# EAGLE design SimpleTimerPCB (EAGLE 6.5.0)
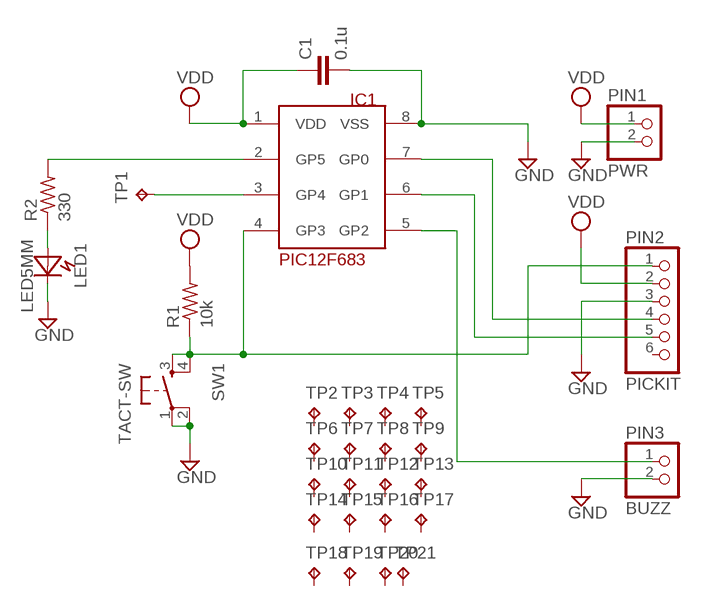
[diagram p0: schematic, sheet 1]

## Parts
C1  0.1u  C-EU025-024X044  [C025-024X044]
LED1  LED5MM  [LED_5MM]
PIC12F683  IC1  PIC12F683DIP  [DIL08]
PIN1  PWR  PINHD-1X2  [1X02]
PIN2  PICKIT  PINHD-1X6  [1X06]
PIN3  BUZZ  PINHD-1X2  [1X02]
R1  10k  R-US_0207/10  [0207/10]
R2  330  R-US_0207/10  [0207/10]
SW1  TACT-SW  [B3F-10X]
TP1  TPPAD1-17  [P1-17]
TP2  TPNORMAL  [TPAD-NORM]
TP3  TPNORMAL  [TPAD-NORM]
TP4  TPNORMAL  [TPAD-NORM]
TP5  TPNORMAL  [TPAD-NORM]
TP6  TPNORMAL  [TPAD-NORM]
TP7  TPNORMAL  [TPAD-NORM]
TP8  TPNORMAL  [TPAD-NORM]
TP9  TPNORMAL  [TPAD-NORM]
TP10  TPNORMAL  [TPAD-NORM]
TP11  TPNORMAL  [TPAD-NORM]
TP12  TPNORMAL  [TPAD-NORM]
TP13  TPNORMAL  [TPAD-NORM]
TP14  TPNORMAL  [TPAD-NORM]
TP15  TPNORMAL  [TPAD-NORM]
TP16  TPNORMAL  [TPAD-NORM]
TP17  TPNORMAL  [TPAD-NORM]
TP18  TPNORMAL  [TPAD-NORM]
TP19  TPNORMAL  [TPAD-NORM]
TP20  TPNORMAL  [TPAD-NORM]
TP21  TPNORMAL  [TPAD-NORM]

## Nets
GND [Power]: C1.2 LED1.K PIC12F683.8(VSS) PIN1.2 PIN2.3 PIN3.2 SW1.1(P) SW1.2(P1)
N$1: PIC12F683.4(GP3) PIN2.1 R1.1 SW1.3(S) SW1.4(S1)
N$3: PIC12F683.3(GP4) TP1.TP
N$4: PIC12F683.7(GP0) PIN2.4
N$5: PIC12F683.6(GP1) PIN2.5
N$6: PIC12F683.5(GP2) PIN3.1
N$7 [Power]: LED1.A R2.1
N$8 [Power]: PIC12F683.2(GP5) R2.2
VDD [Power]: C1.1 PIC12F683.1(VDD) PIN1.1 PIN2.2 R1.2
Unconnected: PIN2.6 TP2.P$1(TP) TP3.P$1(TP) TP4.P$1(TP) TP5.P$1(TP) TP6.P$1(TP) TP7.P$1(TP) TP8.P$1(TP) TP9.P$1(TP) TP10.P$1(TP) TP11.P$1(TP) TP12.P$1(TP) TP13.P$1(TP) TP14.P$1(TP) TP15.P$1(TP) TP16.P$1(TP) TP17.P$1(TP) TP18.P$1(TP) TP19.P$1(TP) TP20.P$1(TP) TP21.P$1(TP)

## Library data of the parts
C1 = MyOriginal:C-EU: CAPACITOR, European symbol
LED1 = MyOriginal:LED: 3mm LED
PIC12F683 = MyOriginal:PIC12F683: PIC12F683 Microchip PIC12F683
PIN1 PIN3 = MyOriginal:PINHD-1X2: PIN HEADER
PIN2 = MyOriginal:PINHD-1X6: PIN HEADER
R1 R2 = rcl:R-US_: RESISTOR, American symbol
SW1 = MyOriginal:TACT-SW: Tacticle Push Switch
TP1-TP21 = MyOriginal:TP: Test pad

## Net classes
0 default: width 0.61 mm, clearance 0.508 mm
1 Power: width 0.914 mm, clearance 0.508 mm
2 GND: width 0.914 mm, clearance 0.508 mm

## Board
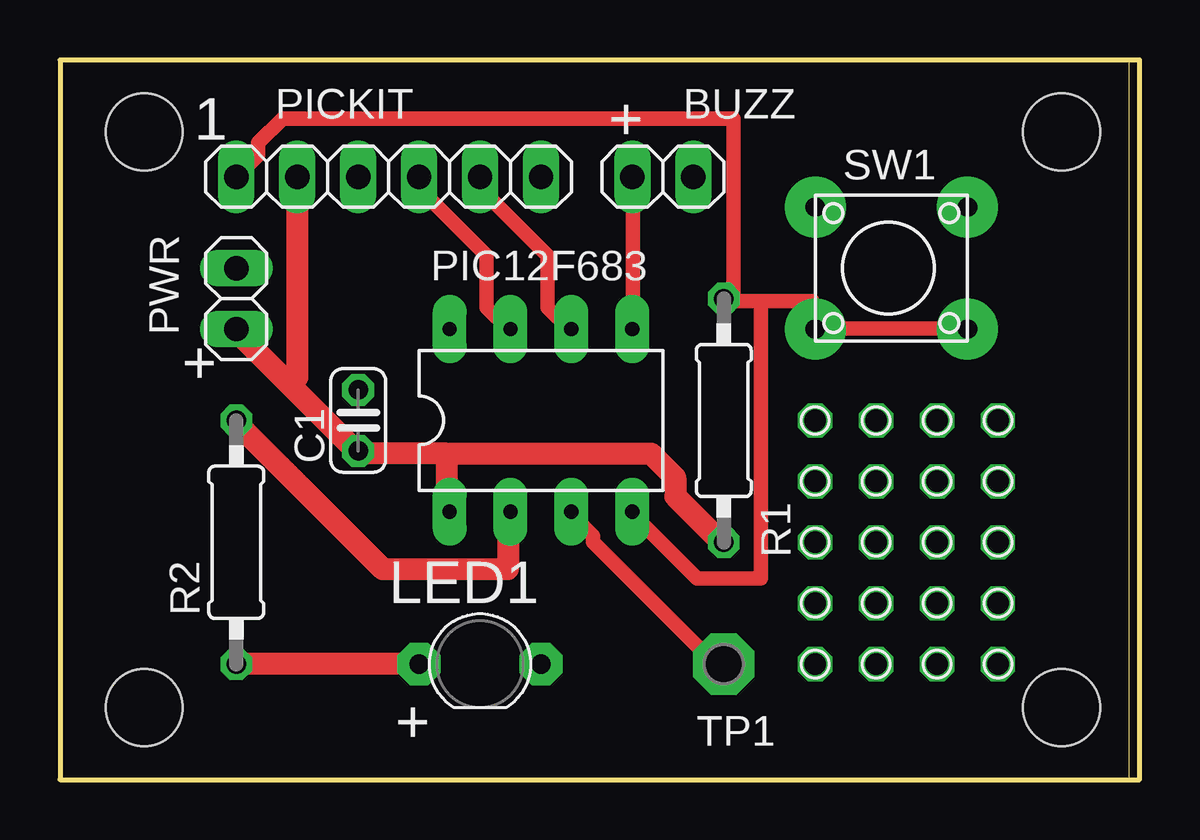
[diagram p1: board, top side]
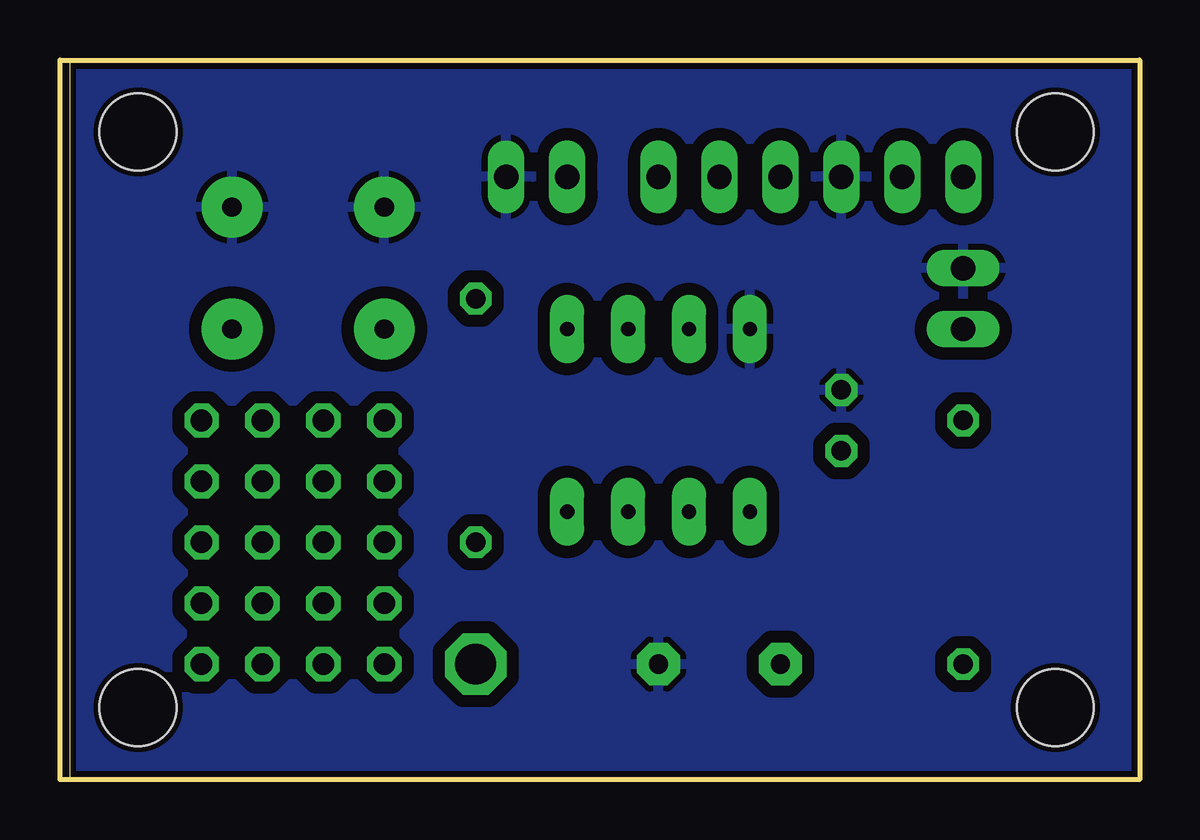
[diagram p2: board, bottom side, seen from below]

Size 45 x 30 mm. Coordinates in mm from the lower left corner, seen from the top.
Outline: 0,0 44.58,0 44.58,29.93 0,29.93 0,0
Outline: 0,0 45,0 45,30 0,30 0,0
Copper layers (1*16): Top 0.035mm / dielectric 1.5mm / Bottom 0.035mm
Design rules "Elecrow_2-layer_eagle_rule": minimum track width 6mil, minimum drill 12mil, track to track 6mil, track to pad 6mil, pad to pad 6mil, via to via 6mil, smd to smd 0mil, copper to edge 10mil, drill to drill 10mil, minimum pad ring 10mil, minimum via ring 6mil, stop-mask expansion 2mil, vias tented up to drill 100mil, thermal gap 10mil
Holes 3.2 mm at 3.51,27 3.51,3 41.75,3 41.75,27

### Footprints (pad centres in the part's own frame; a part is rotated, then mirrored left to right if it is on the bottom)
C025-024X044 = drill 0.813 octagon: 1 -1.27,0; 2 1.27,0
LED_5MM = drill 0.8 pad 1.778 octagon: A -2.54,0; K 2.54,0
DIL08 = drill 0.6 pad 1.422 long: 1 -3.81,-3.81; 2 -1.27,-3.81; 3 1.27,-3.81; 4 3.81,-3.81; 5 3.81,3.81; 6 1.27,3.81; 7 -1.27,3.81; 8 -3.81,3.81
1X02 = drill 1.016 long: 1 -1.27,0; 2 1.27,0
1X06 = drill 1.016 long: 1 -6.35,0; 2 -3.81,0; 3 -1.27,0; 4 1.27,0; 5 3.81,0; 6 6.35,0
0207/10 = drill 0.813 octagon: 1 -5.08,0; 2 5.08,0
B3F-10X = drill 0.8 pad 2.54: 1 -1.27,2.54; 2 5.08,2.54; 3 -1.27,-2.54; 4 5.08,-2.54
P1-17 = drill 1.702 pad 2.54 octagon: TP 0,0
TPAD-NORM = drill 0.9 pad 1.422 octagon: P$1 0,0

### Placement (x,y rotation side)
C1  12.43,14.97 90 top
LED1  17.51,4.81 0 top
PIC12F683  20.05,14.97 0 top
PIN1  7.35,20.05 90 top
PIN2  13.7,25.13 0 top
PIN3  25.13,25.13 0 top
R1  27.67,14.97 270 top
R2  7.35,9.89 90 top
SW1  32.75,21.32 0 top
TP1  27.67,4.81 0 top
TP2  31.48,14.97 0 top
TP3  34.02,14.97 0 top
TP4  36.56,14.97 0 top
TP5  39.1,14.97 0 top
TP6  31.48,12.43 0 top
TP7  34.02,12.43 0 top
TP8  36.56,12.43 0 top
TP9  39.1,12.43 0 top
TP10  31.48,9.89 0 top
TP11  34.02,9.89 0 top
TP12  36.56,9.89 0 top
TP13  39.1,9.89 0 top
TP14  31.48,7.35 0 top
TP15  34.02,7.35 0 top
TP16  36.56,7.35 0 top
TP17  39.1,7.35 0 top
TP18  31.48,4.81 0 top
TP19  34.02,4.81 0 top
TP20  36.56,4.81 0 top
TP21  39.1,4.81 0 top

### Tracks (layer width: path | path; a pad name or v marks a point on that pad's centre or on a via)
GND
  pour Bottom: 0.25,29.46 0.25,0.25 43.94,0.25 43.94,0.51 44.2,0.51 44.2,29.72 0.25,29.72
N$1
  Top 0.61: 29.21,19.94 31.37,19.94 31.37,18.8 SW1.3 31.75,18.8 37.72,18.8 SW1.4 | 29.21,19.94 27.69,19.94 R1.1 28.07,20.19 28.07,27.56 9.27,27.56 8.26,26.54 8.26,26.04 PIN2.1 | 29.21,19.94 29.21,8.38 26.54,8.38 23.88,11.05 PIC12F683.4
N$3
  Top 0.61: PIC12F683.3 21.34,11.05 22.23,10.16 22.23,9.91 27.3,4.83 27.56,4.83 TP1.TP
N$4
  Top 0.61: PIC12F683.7 18.67,18.8 17.78,19.68 17.78,21.84 14.99,24.64 14.99,25.02 PIN2.4
N$5
  Top 0.61: PIC12F683.6 21.21,18.8 20.32,19.68 20.32,21.84 17.53,24.64 17.53,25.02 PIN2.5
N$6
  Top 0.61: PIC12F683.5 23.88,18.8 23.88,25.02 PIN3.1
N$7
  Top 0.914: R2.1 7.37,4.83 14.86,4.83 LED1.A
N$8
  Top 0.914: R2.2 7.37,14.86 13.46,8.76 18.67,8.76 18.67,11.05 PIC12F683.2
VDD
  Top 0.914: 16.13,13.59 12.45,13.59 C1.1 12.06,13.97 9.59,16.45 | 16.13,13.59 16.13,11.18 PIC12F683.1 | 16.13,13.59 24.64,13.59 25.65,12.57 25.65,11.81 27.56,9.91 R1.2 | 9.59,16.45 7.37,18.67 PIN1.1 | PIN2.2 9.91,25.02 9.91,16.76 9.59,16.45

### Text on the board
tNames: PICKIT | BUZZ | 1 | + | PWR | + | +